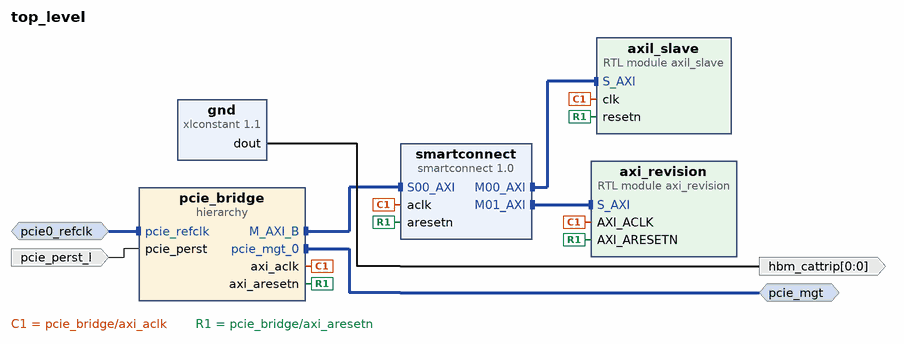
[diagram p0: block diagram of the top level]
# Vivado block design top_level, xcu55c-fsvh2892-2L-e, Vivado 2024.2
create_bd_design top_level

create_bd_intf_port -mode Slave -vlnv xilinx.com:interface:diff_clock_rtl:1.0 pcie0_refclk
create_bd_intf_port -mode Master -vlnv xilinx.com:interface:pcie_7x_mgt_rtl:1.0 pcie_mgt
create_bd_port -dir O -from 0 -to 0 hbm_cattrip
create_bd_port -dir I -type rst pcie_perst_l

create_bd_cell -type hier pcie_bridge
create_bd_cell -type ip -vlnv xilinx.com:ip:smartconnect:1.0 smartconnect
set_property -dict {CONFIG.NUM_MI 2 CONFIG.NUM_SI 1} [get_bd_cells smartconnect]
create_bd_cell -type ip -vlnv xilinx.com:ip:xlconstant:1.1 gnd
set_property -dict {CONFIG.CONST_VAL 0} [get_bd_cells gnd]
create_bd_cell -type module -reference axil_slave axil_slave
create_bd_cell -type module -reference axi_revision axi_revision

# ---- hierarchy /pcie_bridge ----
current_bd_instance /pcie_bridge
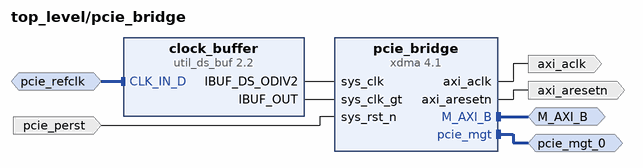
[diagram p1: block diagram inside /pcie_bridge]
create_bd_intf_pin -mode Master -vlnv xilinx.com:interface:pcie_7x_mgt_rtl:1.0 pcie_mgt_0
create_bd_intf_pin -mode Slave -vlnv xilinx.com:interface:diff_clock_rtl:1.0 pcie_refclk
create_bd_intf_pin -mode Master -vlnv xilinx.com:interface:aximm_rtl:1.0 M_AXI_B
create_bd_pin -dir I -type rst pcie_perst
create_bd_pin -dir O axi_aclk
create_bd_pin -dir O axi_aresetn

create_bd_cell -type ip -vlnv xilinx.com:ip:xdma:4.1 pcie_bridge
set_property -dict [list \
  CONFIG.PF0_DEVICE_ID_mqdma 9048 \
  CONFIG.PF0_SRIOV_VF_DEVICE_ID A048 \
  CONFIG.PF2_DEVICE_ID_mqdma 9248 \
  CONFIG.PF3_DEVICE_ID_mqdma 9348 \
  CONFIG.axi_addr_width 64 \
  CONFIG.axi_data_width 512_bit \
  CONFIG.axisten_freq 250 \
  CONFIG.bridge_burst true \
  CONFIG.en_axi_slave_if false \
  CONFIG.en_gt_selection false \
  CONFIG.functional_mode AXI_Bridge \
  CONFIG.mode_selection Advanced \
  CONFIG.pcie_blk_locn PCIE4C_X1Y1 \
  CONFIG.pf0_bar0_scale Megabytes \
  CONFIG.pf0_bar0_size 1 \
  CONFIG.pf0_device_id 903f \
  CONFIG.pf0_msi_enabled false \
  CONFIG.pl_link_cap_max_link_speed 16.0_GT/s \
  CONFIG.pl_link_cap_max_link_width X8 \
  CONFIG.runbit_fix false \
  CONFIG.xlnx_ref_board None \
] [get_bd_cells pcie_bridge]
create_bd_cell -type ip -vlnv xilinx.com:ip:util_ds_buf:2.2 clock_buffer
set_property -dict {CONFIG.C_BUF_TYPE IBUFDSGTE} [get_bd_cells clock_buffer]

# ---- connections ----

current_bd_instance /pcie_bridge
connect_bd_intf_net -intf_net CLK_IN_D_0_1 [get_bd_intf_pins pcie_refclk] [get_bd_intf_pins clock_buffer/CLK_IN_D]
connect_bd_intf_net -intf_net xdma_0_M_AXI_B [get_bd_intf_pins M_AXI_B] [get_bd_intf_pins pcie_bridge/M_AXI_B]
connect_bd_intf_net -intf_net xdma_0_pcie_mgt [get_bd_intf_pins pcie_mgt_0] [get_bd_intf_pins pcie_bridge/pcie_mgt]
connect_bd_net -net sys_rst_n_0_1 [get_bd_pins pcie_perst] [get_bd_pins pcie_bridge/sys_rst_n]
connect_bd_net -net util_ds_buf_0_IBUF_DS_ODIV2 [get_bd_pins clock_buffer/IBUF_DS_ODIV2] [get_bd_pins pcie_bridge/sys_clk]
connect_bd_net -net util_ds_buf_0_IBUF_OUT [get_bd_pins clock_buffer/IBUF_OUT] [get_bd_pins pcie_bridge/sys_clk_gt]
connect_bd_net -net xdma_0_axi_aclk [get_bd_pins pcie_bridge/axi_aclk] [get_bd_pins axi_aclk]
connect_bd_net -net xdma_0_axi_aresetn [get_bd_pins pcie_bridge/axi_aresetn] [get_bd_pins axi_aresetn]

current_bd_instance /
connect_bd_intf_net -intf_net CLK_IN_D_0_1 [get_bd_intf_ports pcie0_refclk] [get_bd_intf_pins pcie_bridge/pcie_refclk]
connect_bd_intf_net -intf_net pcie_bridge_0_M_AXI_B [get_bd_intf_pins pcie_bridge/M_AXI_B] [get_bd_intf_pins smartconnect/S00_AXI]
connect_bd_intf_net [get_bd_intf_pins axil_slave/S_AXI] [get_bd_intf_pins smartconnect/M00_AXI]
connect_bd_intf_net [get_bd_intf_pins smartconnect/M01_AXI] [get_bd_intf_pins axi_revision/S_AXI]
connect_bd_intf_net -intf_net xdma_0_pcie_mgt [get_bd_intf_ports pcie_mgt] [get_bd_intf_pins pcie_bridge/pcie_mgt_0]
connect_bd_net [get_bd_pins gnd/dout] [get_bd_ports hbm_cattrip]
connect_bd_net -net pcie_bridge_0_axi_aclk [get_bd_pins pcie_bridge/axi_aclk] \
  [get_bd_pins smartconnect/aclk] [get_bd_pins axil_slave/clk] [get_bd_pins axi_revision/AXI_ACLK]
connect_bd_net -net pcie_bridge_0_axi_aresetn [get_bd_pins pcie_bridge/axi_aresetn] \
  [get_bd_pins smartconnect/aresetn] [get_bd_pins axil_slave/resetn] [get_bd_pins axi_revision/AXI_ARESETN]
connect_bd_net -net sys_rst_n_0_1 [get_bd_ports pcie_perst_l] [get_bd_pins pcie_bridge/pcie_perst]

# ---- address map ----
assign_bd_address -offset 0x0000000000000000 -range 256 -target_address_space [get_bd_addr_spaces pcie_bridge/pcie_bridge/M_AXI_B] [get_bd_addr_segs axi_revision/S_AXI/reg0]
assign_bd_address -offset 0x0000000000001000 -range 256 -target_address_space [get_bd_addr_spaces pcie_bridge/pcie_bridge/M_AXI_B] [get_bd_addr_segs axil_slave/S_AXI/reg0]

validate_bd_design
save_bd_design
